# EAGLE design FSAE (EAGLE 8.1.0)
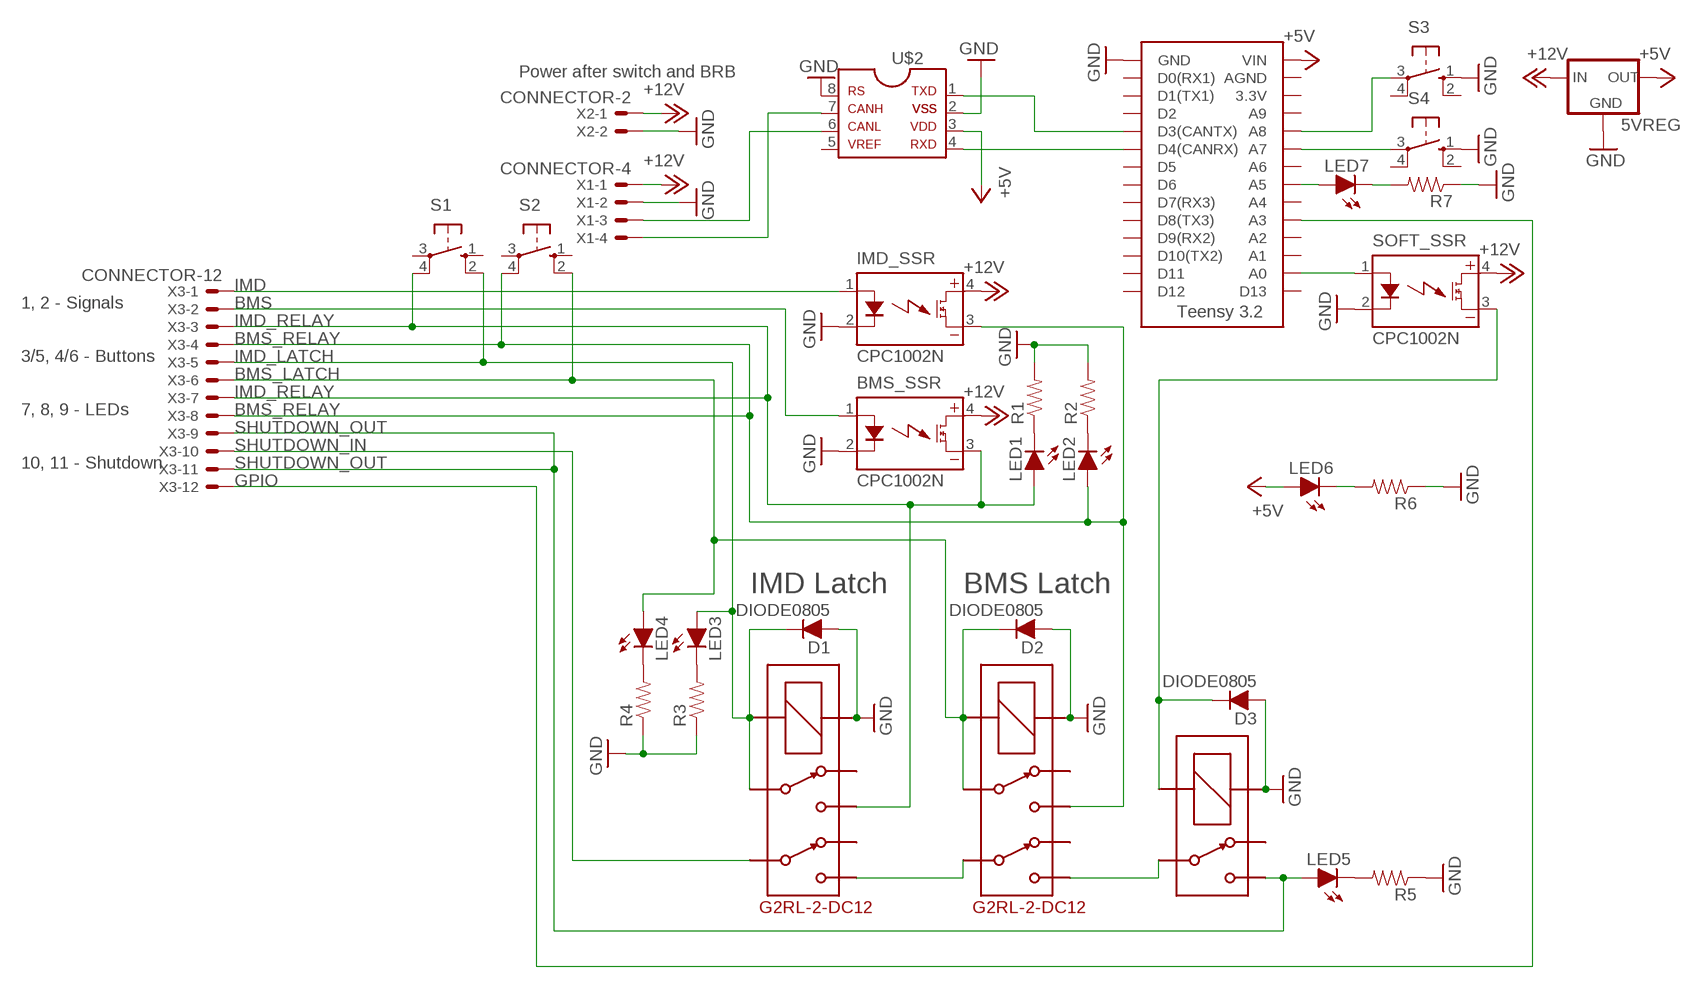
[diagram p0: schematic, sheet 1]

## Parts
5VREG  5VREG_LM340-NLM340MPX-5.0/NOPB  [SOT223]
BMS_SSR  CPC1002N  [SOP04]
D1  DIODE0805  [0805_D]
D2  DIODE0805  [0805_D]
D3  DIODE0805  [0805_D]
IMD_SSR  CPC1002N  [SOP04]
LED1  LED-0805  [LED-805]
LED2  LED-0805  [LED-805]
LED3  LED-0805  [LED-805]
LED4  LED-0805  [LED-805]
LED5  LED-0805  [LED-805]
LED6  LED-0805  [LED-805]
LED7  LED-0805  [LED-805]
R1  RESISTOR0805-RES  [0805]
R2  RESISTOR0805-RES  [0805]
R3  RESISTOR0805-RES  [0805]
R4  RESISTOR0805-RES  [0805]
R5  RESISTOR0805-RES  [0805]
R6  RESISTOR0805-RES  [0805]
R7  RESISTOR0805-RES  [0805]
S1  BTN_10-XX  [B3F-10XX]
S2  BTN_10-XX  [B3F-10XX]
S3  BTN_10-XX  [B3F-10XX]
S4  BTN_10-XX  [B3F-10XX]
SOFT_SSR  CPC1002N  [SOP04]
U$1  TEENSY_3.2_SIMPLE  [TEENSY_3.2_SIMPLE]
U$2  MCP2551  [SOIC-08]
U$3  G2RL-2-DC12  [G2RL-2]
U$4  G2RL-2-DC12  [G2RL-2]
U$5  G5LE  [ZF112]
X1  CONNECTOR-4  [MINIFIT_5566-4]
X2  CONNECTOR-2  [MINIFIT_5566-2]
X3  CONNECTOR-12  [MINIFIT_5566-12]

## Nets
+5V: 5VREG.3(OUT) LED6.A U$1.VIN U$2.3
+12V: 5VREG.1(IN) BMS_SSR.4(DC+) IMD_SSR.4(DC+) SOFT_SSR.4(DC+) X1.1 X2.1
BMS: BMS_SSR.1(CONTROL+) X3.2
BMS_LATCH: D2.C LED4.A S2.2(S1) U$4.3 U$4.COIL- X3.6
BMS_RELAY: IMD_SSR.3(DC-) LED2.A S2.4(P1) U$4.4 X3.4 X3.8
GND: 5VREG.2(GND) 5VREG.4(GND) BMS_SSR.2(CONTROL-) D1.A D2.A D3.A IMD_SSR.2(CONTROL-) R1.2 R2.2 R3.1 R4.1 R5.1 R6.1 R7.1 S3.1(S) S4.1(S) SOFT_SSR.2(CONTROL-) U$1.GND U$2.2 U$2.8 U$3.COIL+ U$4.COIL+ U$5.1(COIL+) X1.2 X2.2
GPIO: U$1.A3 X3.12
IMD: IMD_SSR.1(CONTROL+) X3.1
IMD_LATCH: D1.C LED3.A S1.2(S1) U$3.3 U$3.COIL- X3.5
IMD_RELAY: BMS_SSR.3(DC-) LED1.A S1.4(P1) U$3.4 X3.3 X3.7
N$1: U$3.5 U$4.6
N$2: U$4.5 U$5.P
N$3: U$1.D3(CANTX) U$2.1
N$4: U$1.D4(CANRX) U$2.4
N$5: U$2.6 X1.3
N$6: U$2.7 X1.4
N$7: LED6.C R6.2
N$8: S3.3(P) U$1.A8
N$9: D3.C SOFT_SSR.3(DC-) U$5.2(COIL-)
N$10: LED7.C R7.2
N$11: LED7.A U$1.A5
N$12: S4.3(P) U$1.A7
N$14: SOFT_SSR.1(CONTROL+) U$1.A0
N$15: LED2.C R2.1
N$16: LED1.C R1.1
N$18: LED3.C R3.2
N$19: LED4.C R4.2
N$20: LED5.C R5.2
SHUTDOWN_IN: U$3.6 X3.10
SHUTDOWN_OUT: LED5.A U$5.S X3.9 X3.11
Unconnected: S1.1(S) S1.3(P) S2.1(S) S2.3(P) S3.2(S1) S3.4(P1) S4.2(S1) S4.4(P1) U$1.3.3V U$1.A1 U$1.A2 U$1.A4 U$1.A6 U$1.A9 U$1.AGND U$1.D0(RX1) U$1.D1(TX1) U$1.D2 U$1.D5 U$1.D6 U$1.D7(RX3) U$1.D8(TX3) U$1.D9(RX2) U$1.D10(TX2) U$1.D11 U$1.D12 U$1.D13 U$2.5 U$3.2 U$3.7 U$4.2 U$4.7 U$5.O

## Notes on the sheet
- Power after switch and BRB
- 1, 2 - Signals
- 3/5, 4/6 - Buttons
- 7, 8, 9 - LEDs
- 10, 11 - Shutdown
- IMD Latch | BMS Latch

## Library data of the parts
5VREG = HyTechDevices:5VREG_LM340-N: Voltage Regulator 5v linear voltage regulator Datasheet <http://www.mouser.com/ProductDetail/Texas-Instruments/LM340MPX-50-NOPB/?qs=X1J7HmVL2ZGZwtTFRQ9ItA%3D%3D> MAX current out: 1.5A MAX voltage in: 35V
BMS_SSR IMD_SSR SOFT_SSR = HyTechDevices:CPC1002N: IXYS Solid State Relay .7A
D1-D3 = HyTechDevices:DIODE: DIODE general purpose rectifier
LED1-LED7 = HyTechDevices:LED: Light Emitting Diode (LED) Source: Dangerous Prototypes Eagle Library <https://github.com/DangerousPrototypes/Eagle_Part_Library>
R1-R7 = HyTechDevices:RESISTOR: Resistor Basic schematic elements and footprints for 0603, 1206, and PTH resistors.
S1-S4 = HyTechDevices:BTN_10-XX: Small momentary tactile push button; MPN: B3F-1000; OC_FARNELL: 176432; OC_NEWARK: 36M3542
U$1 = HyTechDevices:TEENSY_3.2_SIMPLE: Simple version of the Teensy 3.2 board that only uses the 2 main rows of pins, not the inner pins or the pins opposite the usb port.
U$2 = HyTechDevices:MCP2551: MCP2551 High-Speed CAN Transceiver Product Webpage <https://www.microchip.com/wwwproducts/en/MCP2551> Datasheet <http://ww1.microchip.com/downloads/en/DeviceDoc/21667f.pdf> This device is outdated It is replaced by MCP2561. Comparison Page <https://www.microchip.com/wwwproducts/ProductCompare/MCP2551/MCP2561> Product Webpage <https://www.microchip.com/wwwproducts/en/MCP2561> Datasheet <http://ww1.microchip.com/downloads/en/DeviceDoc/20005167C.pdf>
U$3 U$4 = HyTechDevices:G2RL-2-DC12: Omron G2RL-2 Double Pull Double Throw Relay Coil Voltage: 12VDC (8.4-18VDC @60ºC) Contact Amperage: 8A at 30VDC Datasheet <https://www.omron.com/ecb/products/pdf/en-g2rl.pdf>
U$5 = HyTechDevices:G5LE: Omron G5LE SPST Relay 5 VDC, 12VDC, 24VDC models Coil voltage: 75% - 170% of nominal voltage Datasheet <https://www.omron.com/ecb/products/pdf/en-g5le.pdf>
X1 = HyTechDevices:CONNECTOR-4: Mini-Fit Junior connector 4 pole Source: http://www.molex.com; OC_FARNELL: unknown; OC_NEWARK: unknown
X2 = HyTechDevices:CONNECTOR-2: Mini-Fit Junior connector 2 pole Source: http://www.molex.com; OC_FARNELL: 1822072; OC_NEWARK: unknown
X3 = HyTechDevices:CONNECTOR-12: Mini-Fit Junior connector 12 pole Source: http://www.molex.com; OC_FARNELL: unknown; OC_NEWARK: unknown

## Board
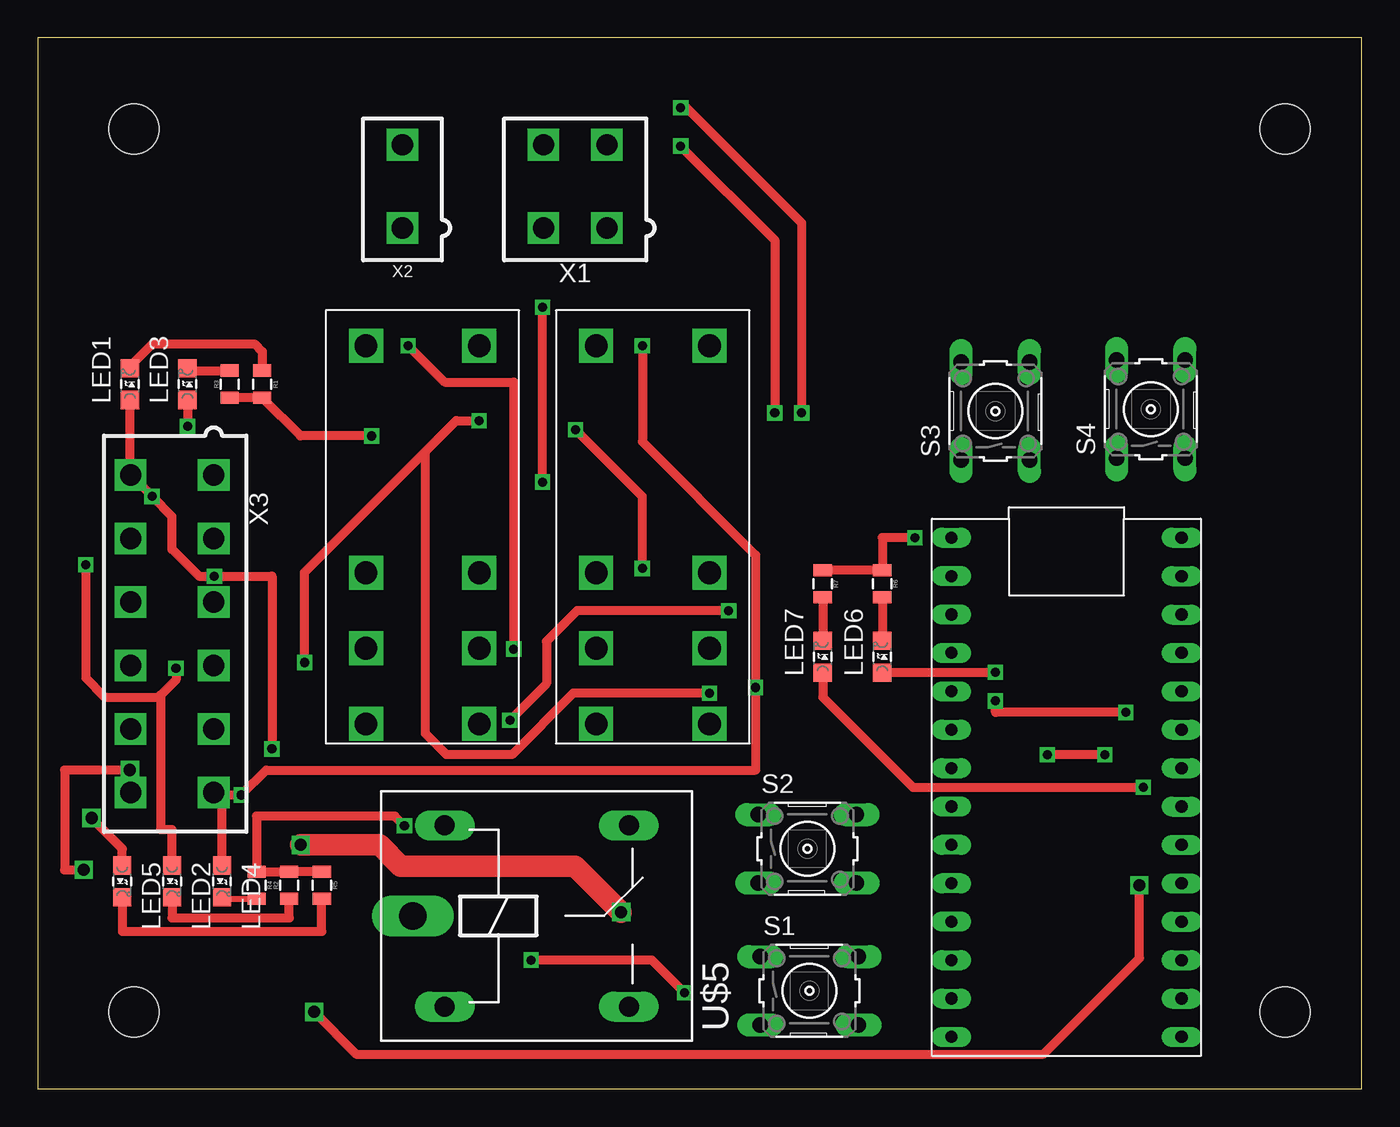
[diagram p1: board, top side]
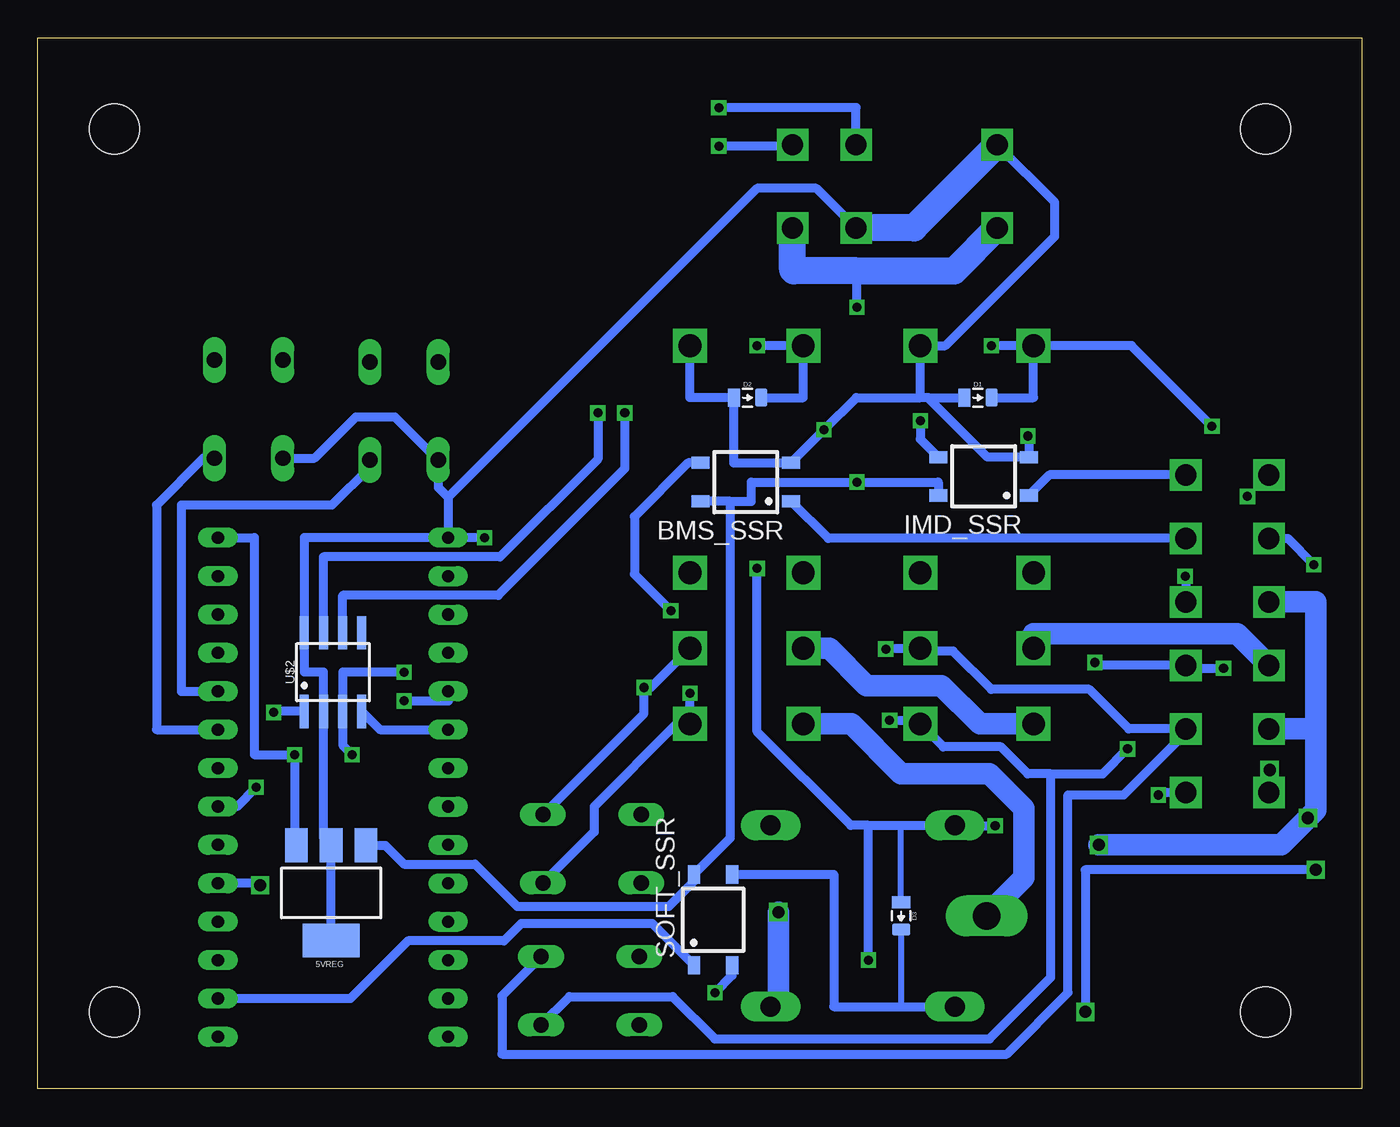
[diagram p2: board, bottom side, seen from below]

Size 87.61 x 69.52 mm. Coordinates in mm from the lower left corner, seen from the top.
Outline: 0,0 87.61,0 87.61,69.52 0,69.52 0,0
Copper layers (1*16): Top 0.035mm / dielectric 1.5mm / Bottom 0.035mm
Design rules "default": minimum track width 10mil, minimum drill 24mil, track to track 8mil, track to pad 8mil, pad to pad 8mil, via to via 8mil, smd to smd 8mil, copper to edge 40mil, drill to drill 8mil, minimum pad ring 10mil, minimum via ring 8mil, stop-mask expansion 4mil, vias tented up to drill 0mil, thermal gap 10mil
Holes 3.3 mm at 6.35,63.5 6.35,5.08 82.55,5.08 82.55,63.5

### Footprints (pad centres in the part's own frame; a part is rotated, then mirrored left to right if it is on the bottom)
SOT223 = smd 1.5 x 2.235: 1 -2.3,-3.15; 2 0,-3.15; 3 2.3,-3.15 | smd 3.8 x 2.2: 4 0,3.15
SOP04 = smd 0.8 x 1.2: 1 -1.27,-3; 2 1.27,-3; 3 1.27,3; 4 -1.27,3
0805_D = smd 0.8 x 1.2: A -0.9,0; C 0.9,0
LED-805 = smd 1.2 x 1.2: A 0,-1.05; C 0,1.05
0805 = smd 0.8 x 1.2: 1 -0.9,0; 2 0.9,0
B3F-10XX = drill 1.016 long: 1 -3.251,2.261; 2 3.251,2.261; 3 -3.251,-2.261; 4 3.251,-2.261
TEENSY_3.2_SIMPLE = drill 0.8 long: 3.3V 16.51,29.21; A0 16.51,3.81; A1 16.51,6.35; A2 16.51,8.89; A3 16.51,11.43; A4 16.51,13.97; A5 16.51,16.51; A6 16.51,19.05; A7 16.51,21.59; A8 16.51,24.13; A9 16.51,26.67; AGND 16.51,31.75; D0(RX1) 1.27,31.75; D1(TX1) 1.27,29.21; D2 1.27,26.67; D3(CANTX) 1.27,24.13; D4(CANRX) 1.27,21.59; D5 1.27,19.05; D6 1.27,16.51; D7(RX3) 1.27,13.97; D8(TX3) 1.27,11.43; D9(RX2) 1.27,8.89; D10(TX2) 1.27,6.35; D11 1.27,3.81; D12 1.27,1.27; D13 16.51,1.27; GND 1.27,34.29; VIN 16.51,34.29
SOIC-08 = smd 0.6 x 2.2: 1 -1.905,-2.6; 2 -0.635,-2.6; 3 0.635,-2.6; 4 1.905,-2.6; 5 1.905,2.6; 6 0.635,2.6; 7 -0.635,2.6; 8 -1.905,2.6
G2RL-2 = drill 1.5 square: 2 10.008,0; 3 5.004,0; 4 0,0; 5 0,7.493; 6 5.004,7.493; 7 10.008,7.493; COIL+ 25.019,0; COIL- 25.019,7.493
ZF112 = drill 1.321 long: 1 4.064,14.884; 2 4.064,2.896; O 16.256,14.884; S 16.256,2.896 | drill 1.803 long: P 1.956,8.89
MINIFIT_5566-4 = drill 1.4 square: 1 2.1,-2.75; 2 -2.1,-2.75; 3 2.1,2.75; 4 -2.1,2.75
MINIFIT_5566-2 = drill 1.4 square: 1 0,-2.75; 2 0,2.75
MINIFIT_5566-12 = drill 1.4 square: 1 10.5,-2.75; 2 6.3,-2.75; 3 2.1,-2.75; 4 -2.1,-2.75; 5 -6.3,-2.75; 6 -10.5,-2.75; 7 10.5,2.75; 8 6.3,2.75; 9 2.1,2.75; 10 -2.1,2.75; 11 -6.3,2.75; 12 -10.5,2.75

### Placement (x,y rotation side)
5VREG  68.2,12.95 180 bottom
BMS_SSR  40.77,40.13 90 bottom
D1  25.4,45.72 0 bottom
D2  40.64,45.72 0 bottom
D3  30.48,11.43 270 bottom
IMD_SSR  25.02,40.51 90 bottom
LED1  6.1,46.61 0 top
LED2  8.89,13.72 180 top
LED3  9.91,46.61 0 top
LED4  12.19,13.72 180 top
LED5  5.59,13.72 180 top
LED6  55.88,28.57 0 top
LED7  51.94,28.57 0 top
R1  14.86,46.61 270 top
R2  16.64,13.46 90 top
R3  12.7,46.61 90 top
R4  14.48,13.46 270 top
R5  18.8,13.46 270 top
R6  55.88,33.4 270 top
R7  51.94,33.4 270 top
S1  51.05,6.48 0 top
S2  50.93,15.88 0 top
S3  63.37,44.83 90 top
S4  73.66,44.96 90 top
SOFT_SSR  42.93,11.18 0 bottom
U$1  59.18,2.16 0 top
U$2  68.07,27.56 0 bottom
U$3  29.21,24.13 90 top
U$4  44.45,24.13 90 top
U$5  22.86,2.54 0 top
X1  35.56,59.69 0 top
X2  24.13,59.69 0 top
X3  8.89,30.1 90 top

### Tracks (layer width: path | path; a pad name or v marks a point on that pad's centre or on a via)
+5V  (via drill 0.6)
  Top 0.61: v70.61,22.1 v66.8,22.1 | LED6.A 55.91,27.56 v63.37,27.56
  Bottom 0.61: 5VREG.3 70.61,16.22 v70.61,22.1 73.28,22.1 73.28,36.45 U$1.VIN | v66.8,22.1 67.44,22.73 U$2.3 67.44,27.56 v63.37,27.56
+12V  (via drill 0.6)
  Top 0.61: v33.4,40.13 v33.4,51.69
  Bottom 0.61: 41.78,38.86 BMS_SSR.4 | 41.78,38.86 40.39,38.86 40.39,40.13 v33.4,40.13 28.02,40.13 IMD_SSR.4 | 41.78,38.86 41.78,16.59 SOFT_SSR.4 44.2,13.72 45.85,12.06 55.88,12.06 58.67,14.86 63.37,14.86 64.62,16.1 5VREG.1 | v33.4,51.69 33.4,54.1
  Bottom 1.778: X2.1 26.97,54.1 33.4,54.1 37.59,54.1 37.66,54.17 X1.1
BMS
  Bottom 0.61: X3.2 35.3,36.4 BMS_SSR.1
BMS_LATCH  (via drill 0.6)
  Top 0.61: LED4.A 12.19,19.43 v13.46,19.43 15.11,21.08 47.5,21.08 v47.5,26.54 47.5,35.31 40.01,42.8 v40.01,49.15
  Bottom 0.61: D2.C 36.96,45.72 U$4.COIL- v40.01,49.15 | v13.46,19.43 13.46,19.6 X3.6 | U$4.3 47.04,26.54 v47.5,26.54 47.5,24.82 S2.2
BMS_RELAY  (via drill 0.6)
  Top 0.61: LED2.A 8.89,17.14 8.13,17.14 8.13,26.04 | v3.17,34.67 3.17,27.18 4.45,25.91 8,25.91 8.13,26.04 | v9.14,27.81 9.14,27.05 8.13,26.04 | v17.65,28.19 17.65,34.16 25.65,42.16 | 25.65,42.16 27.69,44.2 v29.21,44.2 | v44.45,26.16 35.43,26.16 31.37,22.1 27.05,22.1 25.65,23.5 25.65,42.16
  Bottom 0.61: v9.14,27.81 11.45,27.81 X3.4 17.46,28 v17.65,28.19 | X3.8 4.9,36.4 v3.17,34.67 | v29.21,44.2 29.21,42.97 IMD_SSR.3 | S2.4 50.8,16.99 50.8,18.67 45.34,24.13 U$4.4 v44.45,26.16
GND  (via drill 0.6)
  Top 0.61: R5.1 R2.2 R4.1 14.48,18.03 23.62,18.03 v24.26,17.4 | R3.1 R1.2 17.39,43.18 v22.1,43.18 | v42.8,6.35 40.64,8.51 v32.64,8.51 | v40.01,34.42 40.01,39.16 v35.58,43.59 | R7.1 R6.1 55.88,36.45 v58.04,36.45
  Bottom 0.406: D3.A 30.48,17.42 | U$5.1 26.92,17.4
  Bottom 0.61: 28.7,45.72 D1.A | 28.7,45.72 29.21,45.72 | 26.92,17.4 v24.26,17.4 | 28.7,45.72 24.77,41.78 IMD_SSR.2 22.02,43.1 v22.1,43.18 | SOFT_SSR.2 41.66,7.49 v42.8,6.35 | v32.64,8.51 32.64,17.42 | 32.64,17.42 30.48,17.42 U$5.1 | 29.21,45.72 33.45,45.72 v35.58,43.59 BMS_SSR.2 41.54,41.4 D2.A 44.45,45.72 U$4.COIL+ | 29.21,45.72 U$3.COIL+ 27.56,49.15 20.32,56.39 20.32,58.63 X2.2 | 32.64,17.42 33.81,17.42 40.01,23.62 v40.01,34.42 | 5VREG.4 5VREG.2 68.71,16.61 U$2.2 68.71,27.56 69.98,27.56 U$2.8 69.98,36.45 U$1.GND | v58.04,36.45 U$1.GND | X1.2 36.08,59.56 40.01,59.56 60.45,39.12 | 60.45,39.12 U$1.GND | 60.45,39.12 61.11,39.78 S3.1 63.98,44.45 66.55,44.45 69.29,41.71 S4.1
  Bottom 1.778: X2.2 29.63,56.94 X1.2
GPIO  (via drill 0.8)
  Top 0.61: v6.1,21.08 1.78,21.08 1.78,14.48 v3.05,14.48 | v18.29,5.08 21.08,2.29 66.55,2.29 72.9,8.64 v72.9,13.46
  Bottom 0.61: X3.12 6.14,21.08 v6.1,21.08 | v3.05,14.48 18.29,14.48 v18.29,5.08 | v72.9,13.46 73.03,13.59 U$1.A3
IMD
  Bottom 0.61: X3.1 20.66,40.6 IMD_SSR.1
IMD_LATCH  (via drill 0.6)
  Top 0.61: LED3.A v9.91,43.81 | v24.51,49.15 26.92,46.74 31.5,46.74 v31.5,29.08
  Bottom 0.61: D1.C 21.72,45.72 U$3.COIL- | v9.91,43.81 15.24,49.15 U$3.COIL- | S1.2 56.9,6.15 56.9,2.29 23.5,2.29 19.43,6.35 19.43,19.43 15.75,19.43 11.64,23.54 X3.5 15.42,23.8 18.03,26.42 24.51,26.42 27.05,28.96 29.03,28.96 U$3.3 31.5,29.13 v31.5,29.08 | U$3.COIL- v24.51,49.15
IMD_RELAY  (via drill 0.6)
  Top 0.61: v15.49,22.48 15.49,33.91 v11.68,33.91 10.67,33.91 8.89,35.69 8.89,37.85 v7.56,39.18 X3.7 6.1,40.64 LED1.A | v45.72,31.62 35.69,31.62 33.66,29.59 33.66,26.8 v31.24,24.38
  Bottom 0.61: v11.68,33.91 11.64,33.87 X3.3 | 20.57,20.83 22.1,20.83 23.88,22.61 27.69,22.61 U$3.4 29.46,24.38 v31.24,24.38 | 20.57,20.83 17.14,20.83 v15.49,22.48 | S1.4 52.43,6.1 45.59,6.1 42.8,3.3 24.64,3.3 20.57,7.37 20.57,20.83 | BMS_SSR.3 44.58,41.4 48.13,37.85 48.13,34.04 v45.72,31.62
N$1
  Bottom 1.422: U$4.6 35.23,29.13 32.77,26.67 27.81,26.67 25.27,24.13 U$3.5
N$2
  Bottom 1.016: 24.82,11.51 U$5.P
  Bottom 1.422: 24.82,11.51 22.35,13.97 22.35,18.54 24.64,20.83 30.48,20.83 33.78,24.13 U$4.5
N$3  (via drill 0.6)
  Top 0.61: v72.01,24.89 63.37,24.89 v63.37,25.65
  Bottom 0.61: U$2.1 72.01,24.96 v72.01,24.89 | v63.37,25.65 60.45,25.65 U$1.D3(CANTX)
N$4
  Bottom 0.61: U$2.4 64.96,23.75 U$1.D4(CANRX)
N$5  (via drill 0.6)
  Top 0.61: v42.55,62.36 48.77,56.13 v48.77,44.7
  Bottom 0.61: U$2.6 67.44,32.64 57.15,32.64 48.77,41.02 v48.77,44.7 | X1.3 37.66,62.36 v42.55,62.36
N$6  (via drill 0.6)
  Top 0.61: v42.55,64.9 42.93,64.9 50.55,57.28 v50.55,44.7
  Bottom 0.61: U$2.7 68.71,35.18 57.02,35.18 50.55,41.66 v50.55,44.7 | X1.4 33.46,64.9 v42.55,64.9
N$7
  Top 0.61: R6.2 LED6.C
N$8
  Bottom 0.61: U$1.A8 78.11,26.29 78.11,38.61 68.15,38.61 65.63,41.12 S3.3
N$9
  Bottom 0.406: D3.C 30.48,5.44
  Bottom 0.61: SOFT_SSR.3 34.92,14.18 34.92,5.44 30.48,5.44 U$5.2
N$10
  Top 0.61: R7.2 LED7.C
N$11  (via drill 0.6)
  Top 0.61: LED7.A 51.94,25.91 57.91,19.94 v73.15,19.94
  Bottom 0.61: v73.15,19.94 74.42,18.67 U$1.A5
N$12
  Bottom 0.61: S4.3 76.66,41.71 79.76,38.61 79.76,23.75 U$1.A7
N$14
  Bottom 0.61: SOFT_SSR.1 46.94,10.92 55.63,10.92 56.77,9.78 63.12,9.78 66.93,5.97 U$1.A0
N$15
  Top 0.61: LED2.C 8.89,11.3 16.64,11.3 R2.1
N$16
  Top 0.61: LED1.C 6.1,47.75 7.62,49.28 14.35,49.28 14.86,48.77 R1.1
N$18
  Top 0.61: LED3.C 10.06,47.51 R3.2
N$19
  Top 0.406: LED4.C 12.19,12.56 R4.2
N$20
  Top 0.61: LED5.C 5.59,10.41 18.8,10.41 R5.2
SHUTDOWN_IN
  Bottom 1.422: X3.10 8.24,30.1 21.72,30.1 U$3.6
SHUTDOWN_OUT  (via drill 0.8)
  Top 0.61: LED5.A 5.59,15.88 v3.56,17.91
  Top 1.422: v38.61,11.68 35.56,14.73 24,14.73 22.61,16.13 v17.4,16.13
  Bottom 1.422: U$5.S 38.61,5.44 v38.61,11.68 | 3.05,23.8 X3.11 | X3.9 3.05,32.2 3.05,23.8 | 3.05,23.8 3.05,18.41 v3.56,17.91 5.33,16.13 v17.4,16.13

### Text on the board
tDocu: IMD | Latch | Out | BMS | Latch | HyTech 2017 Charge rev0